# EAGLE schematic etherchess (EAGLE 7.3.0)
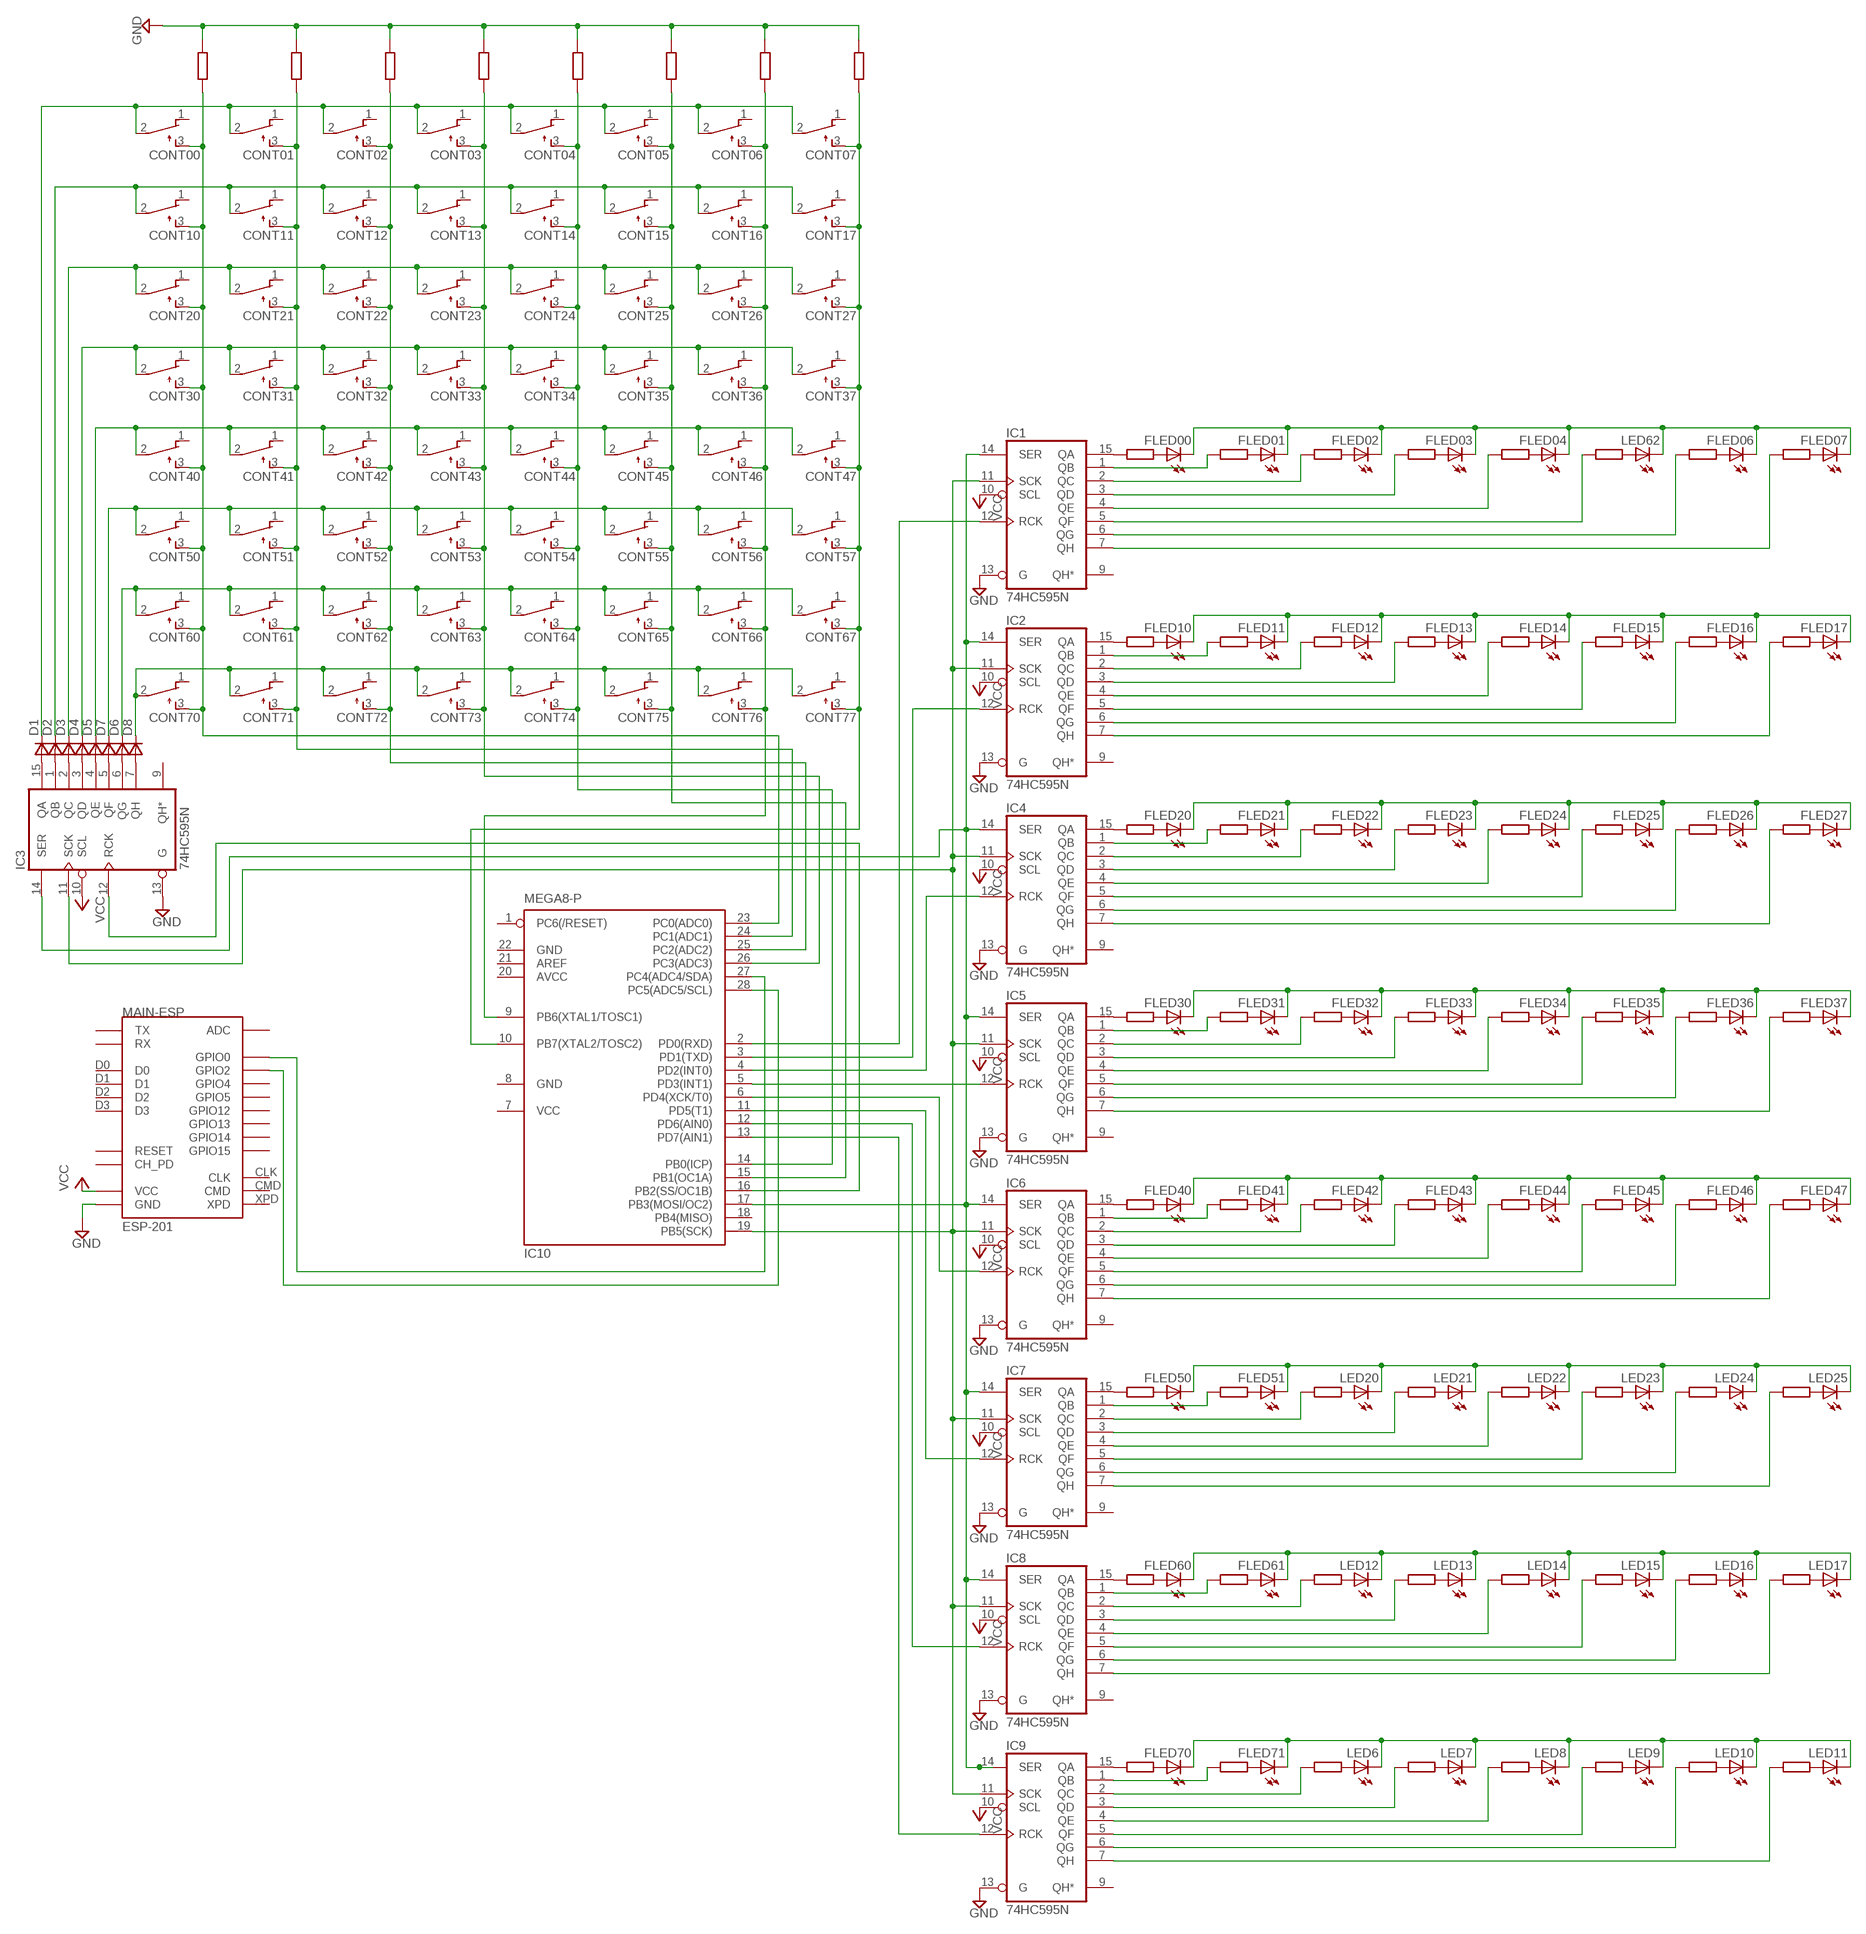
[diagram p0: schematic, sheet 1]

## Parts
CONT00  TL32PO  [TL3XPO]
CONT01  TL32PO  [TL3XPO]
CONT02  TL32PO  [TL3XPO]
CONT03  TL32PO  [TL3XPO]
CONT04  TL32PO  [TL3XPO]
CONT05  TL32PO  [TL3XPO]
CONT06  TL32PO  [TL3XPO]
CONT07  TL32PO  [TL3XPO]
CONT10  TL32PO  [TL3XPO]
CONT11  TL32PO  [TL3XPO]
CONT12  TL32PO  [TL3XPO]
CONT13  TL32PO  [TL3XPO]
CONT14  TL32PO  [TL3XPO]
CONT15  TL32PO  [TL3XPO]
CONT16  TL32PO  [TL3XPO]
CONT17  TL32PO  [TL3XPO]
CONT20  TL32PO  [TL3XPO]
CONT21  TL32PO  [TL3XPO]
CONT22  TL32PO  [TL3XPO]
CONT23  TL32PO  [TL3XPO]
CONT24  TL32PO  [TL3XPO]
CONT25  TL32PO  [TL3XPO]
CONT26  TL32PO  [TL3XPO]
CONT27  TL32PO  [TL3XPO]
CONT30  TL32PO  [TL3XPO]
CONT31  TL32PO  [TL3XPO]
CONT32  TL32PO  [TL3XPO]
CONT33  TL32PO  [TL3XPO]
CONT34  TL32PO  [TL3XPO]
CONT35  TL32PO  [TL3XPO]
CONT36  TL32PO  [TL3XPO]
CONT37  TL32PO  [TL3XPO]
CONT40  TL32PO  [TL3XPO]
CONT41  TL32PO  [TL3XPO]
CONT42  TL32PO  [TL3XPO]
CONT43  TL32PO  [TL3XPO]
CONT44  TL32PO  [TL3XPO]
CONT45  TL32PO  [TL3XPO]
CONT46  TL32PO  [TL3XPO]
CONT47  TL32PO  [TL3XPO]
CONT50  TL32PO  [TL3XPO]
CONT51  TL32PO  [TL3XPO]
CONT52  TL32PO  [TL3XPO]
CONT53  TL32PO  [TL3XPO]
CONT54  TL32PO  [TL3XPO]
CONT55  TL32PO  [TL3XPO]
CONT56  TL32PO  [TL3XPO]
CONT57  TL32PO  [TL3XPO]
CONT60  TL32PO  [TL3XPO]
CONT61  TL32PO  [TL3XPO]
CONT62  TL32PO  [TL3XPO]
CONT63  TL32PO  [TL3XPO]
CONT64  TL32PO  [TL3XPO]
CONT65  TL32PO  [TL3XPO]
CONT66  TL32PO  [TL3XPO]
CONT67  TL32PO  [TL3XPO]
CONT70  TL32PO  [TL3XPO]
CONT71  TL32PO  [TL3XPO]
CONT72  TL32PO  [TL3XPO]
CONT73  TL32PO  [TL3XPO]
CONT74  TL32PO  [TL3XPO]
CONT75  TL32PO  [TL3XPO]
CONT76  TL32PO  [TL3XPO]
CONT77  TL32PO  [TL3XPO]
D1  DSOD323  [SOD323]
D2  DSOD323  [SOD323]
D3  DSOD323  [SOD323]
D4  DSOD323  [SOD323]
D5  DSOD323  [SOD323]
D6  DSOD323  [SOD323]
D7  DSOD323  [SOD323]
D8  DSOD323  [SOD323]
FLED00  LED5MM  [LED5MM]
FLED01  LED5MM  [LED5MM]
FLED02  LED5MM  [LED5MM]
FLED03  LED5MM  [LED5MM]
FLED04  LED5MM  [LED5MM]
FLED06  LED5MM  [LED5MM]
FLED07  LED5MM  [LED5MM]
FLED10  LED5MM  [LED5MM]
FLED11  LED5MM  [LED5MM]
FLED12  LED5MM  [LED5MM]
FLED13  LED5MM  [LED5MM]
FLED14  LED5MM  [LED5MM]
FLED15  LED5MM  [LED5MM]
FLED16  LED5MM  [LED5MM]
FLED17  LED5MM  [LED5MM]
FLED20  LED5MM  [LED5MM]
FLED21  LED5MM  [LED5MM]
FLED22  LED5MM  [LED5MM]
FLED23  LED5MM  [LED5MM]
FLED24  LED5MM  [LED5MM]
FLED25  LED5MM  [LED5MM]
FLED26  LED5MM  [LED5MM]
FLED27  LED5MM  [LED5MM]
FLED30  LED5MM  [LED5MM]
FLED31  LED5MM  [LED5MM]
FLED32  LED5MM  [LED5MM]
FLED33  LED5MM  [LED5MM]
FLED34  LED5MM  [LED5MM]
FLED35  LED5MM  [LED5MM]
FLED36  LED5MM  [LED5MM]
FLED37  LED5MM  [LED5MM]
FLED40  LED5MM  [LED5MM]
FLED41  LED5MM  [LED5MM]
FLED42  LED5MM  [LED5MM]
FLED43  LED5MM  [LED5MM]
FLED44  LED5MM  [LED5MM]
FLED45  LED5MM  [LED5MM]
FLED46  LED5MM  [LED5MM]
FLED47  LED5MM  [LED5MM]
FLED50  LED5MM  [LED5MM]
FLED51  LED5MM  [LED5MM]
FLED60  LED5MM  [LED5MM]
FLED61  LED5MM  [LED5MM]
FLED70  LED5MM  [LED5MM]
FLED71  LED5MM  [LED5MM]
IC1  74HC595N  [DIL16]
IC2  74HC595N  [DIL16]
IC3  74HC595N  [DIL16]
IC4  74HC595N  [DIL16]
IC5  74HC595N  [DIL16]
IC6  74HC595N  [DIL16]
IC7  74HC595N  [DIL16]
IC8  74HC595N  [DIL16]
IC9  74HC595N  [DIL16]
IC10  MEGA8-P  [DIL28-3]
LED6  LED5MM  [LED5MM]
LED7  LED5MM  [LED5MM]
LED8  LED5MM  [LED5MM]
LED9  LED5MM  [LED5MM]
LED10  LED5MM  [LED5MM]
LED11  LED5MM  [LED5MM]
LED12  LED5MM  [LED5MM]
LED13  LED5MM  [LED5MM]
LED14  LED5MM  [LED5MM]
LED15  LED5MM  [LED5MM]
LED16  LED5MM  [LED5MM]
LED17  LED5MM  [LED5MM]
LED20  LED5MM  [LED5MM]
LED21  LED5MM  [LED5MM]
LED22  LED5MM  [LED5MM]
LED23  LED5MM  [LED5MM]
LED24  LED5MM  [LED5MM]
LED25  LED5MM  [LED5MM]
LED62  LED5MM  [LED5MM]
MAIN-ESP  ESP-201  [ESP-201]

## Nets
GND: IC1.13(G) IC2.13(G) IC3.13(G) IC4.13(G) IC5.13(G) IC6.13(G) IC7.13(G) IC8.13(G) IC9.13(G) MAIN-ESP.GND MAIN-ESP.GND_2(GND) MAIN-ESP.GND_3(GND)
N$1: IC2.1(QB)
N$2: IC2.2(QC)
N$3: IC2.3(QD)
N$4: IC2.4(QE)
N$5: IC2.5(QF)
N$6: IC2.6(QG)
N$7: IC2.7(QH)
N$8: IC4.1(QB)
N$9: IC4.2(QC)
N$10: IC4.3(QD)
N$11: IC4.4(QE)
N$12: IC4.5(QF)
N$13: IC4.6(QG)
N$14: IC4.7(QH)
N$15: IC5.1(QB)
N$16: IC5.2(QC)
N$17: IC1.1(QB)
N$18: CONT70.2(P) CONT71.2(P) CONT72.2(P) CONT73.2(P) CONT74.2(P) CONT75.2(P) CONT76.2(P) CONT77.2(P) D8.1(C)
N$19: CONT60.2(P) CONT61.2(P) CONT62.2(P) CONT63.2(P) CONT64.2(P) CONT65.2(P) CONT66.2(P) CONT67.2(P) D6.1(C)
N$20: CONT50.2(P) CONT51.2(P) CONT52.2(P) CONT53.2(P) CONT54.2(P) CONT55.2(P) CONT56.2(P) CONT57.2(P) D7.1(C)
N$21: CONT40.2(P) CONT41.2(P) CONT42.2(P) CONT43.2(P) CONT44.2(P) CONT45.2(P) CONT46.2(P) CONT47.2(P) D5.1(C)
N$22: CONT30.2(P) CONT31.2(P) CONT32.2(P) CONT33.2(P) CONT34.2(P) CONT35.2(P) CONT36.2(P) CONT37.2(P) D4.1(C)
N$23: CONT20.2(P) CONT21.2(P) CONT22.2(P) CONT23.2(P) CONT24.2(P) CONT25.2(P) CONT26.2(P) CONT27.2(P) D3.1(C)
N$24: CONT10.2(P) CONT11.2(P) CONT12.2(P) CONT13.2(P) CONT14.2(P) CONT15.2(P) CONT16.2(P) CONT17.2(P) D2.1(C)
N$25: CONT00.2(P) CONT01.2(P) CONT02.2(P) CONT03.2(P) CONT04.2(P) CONT05.2(P) CONT06.2(P) CONT07.2(P) D1.1(C)
N$26: CONT00.3(S) CONT10.3(S) CONT20.3(S) CONT30.3(S) CONT40.3(S) CONT50.3(S) CONT60.3(S) CONT70.3(S) IC10.23(PC0(ADC0))
N$27: CONT01.3(S) CONT11.3(S) CONT21.3(S) CONT31.3(S) CONT41.3(S) CONT51.3(S) CONT61.3(S) CONT71.3(S) IC10.24(PC1(ADC1))
N$28: CONT02.3(S) CONT12.3(S) CONT22.3(S) CONT32.3(S) CONT42.3(S) CONT52.3(S) CONT62.3(S) CONT72.3(S) IC10.25(PC2(ADC2))
N$29: CONT03.3(S) CONT13.3(S) CONT23.3(S) CONT33.3(S) CONT43.3(S) CONT53.3(S) CONT63.3(S) CONT73.3(S) IC10.26(PC3(ADC3))
N$30: CONT04.3(S) CONT14.3(S) CONT24.3(S) CONT34.3(S) CONT44.3(S) CONT54.3(S) CONT64.3(S) CONT74.3(S) IC10.14(PB0(ICP))
N$31: CONT05.3(S) CONT15.3(S) CONT25.3(S) CONT35.3(S) CONT45.3(S) CONT55.3(S) CONT65.3(S) CONT75.3(S) IC10.15(PB1(OC1A))
N$32: CONT06.3(S) CONT16.3(S) CONT26.3(S) CONT36.3(S) CONT46.3(S) CONT56.3(S) CONT66.3(S) CONT76.3(S) IC10.9(PB6(XTAL1/TOSC1))
N$33: CONT07.3(S) CONT17.3(S) CONT27.3(S) CONT37.3(S) CONT47.3(S) CONT57.3(S) CONT67.3(S) CONT77.3(S) IC10.10(PB7(XTAL2/TOSC2))
N$34: IC1.2(QC)
N$35: IC1.14(SER) IC2.14(SER) IC3.14(SER) IC4.14(SER) IC5.14(SER) IC6.14(SER) IC7.14(SER) IC8.14(SER) IC9.14(SER) IC10.17(PB3(MOSI/OC2))
N$36: IC1.3(QD)
N$37: IC1.4(QE)
N$38: IC1.5(QF)
N$39: IC1.6(QG)
N$40: IC1.7(QH)
N$41: IC5.3(QD)
N$42: IC5.4(QE)
N$43: IC5.5(QF)
N$44: IC5.6(QG)
N$45: IC5.7(QH)
N$46: IC6.1(QB)
N$47: IC6.2(QC)
N$48: IC6.3(QD)
N$49: IC6.4(QE)
N$50: IC6.5(QF)
N$51: IC6.6(QG)
N$52: IC6.7(QH)
N$53: IC7.1(QB)
N$54: IC7.2(QC)
N$55: IC7.3(QD)
N$56: IC7.4(QE)
N$57: IC7.5(QF)
N$58: IC7.6(QG)
N$59: IC7.7(QH)
N$60: IC8.1(QB)
N$61: IC8.2(QC)
N$62: IC8.3(QD)
N$63: IC8.4(QE)
N$64: IC8.5(QF)
N$65: IC8.6(QG)
N$66: IC8.7(QH)
N$67: IC9.1(QB)
N$68: IC9.2(QC)
N$69: IC9.3(QD)
N$70: IC9.4(QE)
N$71: IC9.5(QF)
N$72: IC9.6(QG)
N$73: IC9.7(QH)
N$74: IC3.12(RCK) IC10.16(PB2(SS/OC1B))
N$75: IC1.11(SCK) IC2.11(SCK) IC3.11(SCK) IC4.11(SCK) IC5.11(SCK) IC6.11(SCK) IC7.11(SCK) IC8.11(SCK) IC9.11(SCK) IC10.19(PB5(SCK))
N$76: IC6.12(RCK) IC10.6(PD4(XCK/T0))
N$77: IC5.12(RCK) IC10.5(PD3(INT1))
N$78: IC4.12(RCK) IC10.4(PD2(INT0))
N$79: IC2.12(RCK) IC10.3(PD1(TXD))
N$80: IC1.12(RCK) IC10.2(PD0(RXD))
N$81: IC7.12(RCK) IC10.11(PD5(T1))
N$82: IC8.12(RCK) IC10.12(PD6(AIN0))
N$83: IC9.12(RCK) IC10.13(PD7(AIN1))
N$84: D1.2(A) IC3.15(QA)
N$85: D2.2(A) IC3.1(QB)
N$86: D3.2(A) IC3.2(QC)
N$87: D4.2(A) IC3.3(QD)
N$88: D5.2(A) IC3.4(QE)
N$89: D6.2(A) IC3.6(QG)
N$90: D7.2(A) IC3.5(QF)
N$91: D8.2(A) IC3.7(QH)
N$92: FLED00.K(C) FLED01.K(C) FLED02.K(C) FLED03.K(C) FLED04.K(C) FLED06.K(C) FLED07.K(C) LED62.K(C)
N$93: FLED10.K(C) FLED11.K(C) FLED12.K(C) FLED13.K(C) FLED14.K(C) FLED15.K(C) FLED16.K(C) FLED17.K(C)
N$94: FLED20.K(C) FLED21.K(C) FLED22.K(C) FLED23.K(C) FLED24.K(C) FLED25.K(C) FLED26.K(C) FLED27.K(C)
N$95: FLED30.K(C) FLED31.K(C) FLED32.K(C) FLED33.K(C) FLED34.K(C) FLED35.K(C) FLED36.K(C) FLED37.K(C)
N$96: FLED40.K(C) FLED41.K(C) FLED42.K(C) FLED43.K(C) FLED44.K(C) FLED45.K(C) FLED46.K(C) FLED47.K(C)
N$97: FLED50.K(C) FLED51.K(C) LED20.K(C) LED21.K(C) LED22.K(C) LED23.K(C) LED24.K(C) LED25.K(C)
N$98: FLED60.K(C) FLED61.K(C) LED12.K(C) LED13.K(C) LED14.K(C) LED15.K(C) LED16.K(C) LED17.K(C)
N$99: FLED70.K(C) FLED71.K(C) LED6.K(C) LED7.K(C) LED8.K(C) LED9.K(C) LED10.K(C) LED11.K(C)
N$100: IC10.27(PC4(ADC4/SDA)) MAIN-ESP.GPIO0
N$101: IC10.28(PC5(ADC5/SCL)) MAIN-ESP.GPIO2
VCC: IC1.10(SCL) IC2.10(SCL) IC3.10(SCL) IC4.10(SCL) IC5.10(SCL) IC6.10(SCL) IC7.10(SCL) IC8.10(SCL) IC9.10(SCL) MAIN-ESP.3V3(VCC) MAIN-ESP.3V3_2(VCC) MAIN-ESP.3V3_3(VCC)
Unconnected: CONT00.1(O) CONT01.1(O) CONT02.1(O) CONT03.1(O) CONT04.1(O) CONT05.1(O) CONT06.1(O) CONT07.1(O) CONT10.1(O) CONT11.1(O) CONT12.1(O) CONT13.1(O) CONT14.1(O) CONT15.1(O) CONT16.1(O) CONT17.1(O) CONT20.1(O) CONT21.1(O) CONT22.1(O) CONT23.1(O) CONT24.1(O) CONT25.1(O) CONT26.1(O) CONT27.1(O) CONT30.1(O) CONT31.1(O) CONT32.1(O) CONT33.1(O) CONT34.1(O) CONT35.1(O) CONT36.1(O) CONT37.1(O) CONT40.1(O) CONT41.1(O) CONT42.1(O) CONT43.1(O) CONT44.1(O) CONT45.1(O) CONT46.1(O) CONT47.1(O) CONT50.1(O) CONT51.1(O) CONT52.1(O) CONT53.1(O) CONT54.1(O) CONT55.1(O) CONT56.1(O) CONT57.1(O) CONT60.1(O) CONT61.1(O) CONT62.1(O) CONT63.1(O) CONT64.1(O) CONT65.1(O) CONT66.1(O) CONT67.1(O) CONT70.1(O) CONT71.1(O) CONT72.1(O) CONT73.1(O) CONT74.1(O) CONT75.1(O) CONT76.1(O) CONT77.1(O) FLED00.A FLED01.A FLED02.A FLED03.A FLED04.A FLED06.A FLED07.A FLED10.A FLED11.A FLED12.A FLED13.A FLED14.A FLED15.A FLED16.A FLED17.A FLED20.A FLED21.A FLED22.A FLED23.A FLED24.A FLED25.A FLED26.A FLED27.A FLED30.A FLED31.A FLED32.A FLED33.A FLED34.A FLED35.A FLED36.A FLED37.A FLED40.A FLED41.A FLED42.A FLED43.A FLED44.A FLED45.A FLED46.A FLED47.A FLED50.A FLED51.A FLED60.A FLED61.A FLED70.A FLED71.A IC1.9(QH*) IC1.15(QA) IC2.9(QH*) IC2.15(QA) IC3.9(QH*) IC4.9(QH*) IC4.15(QA) IC5.9(QH*) IC5.15(QA) IC6.9(QH*) IC6.15(QA) IC7.9(QH*) IC7.15(QA) IC8.9(QH*) IC8.15(QA) IC9.9(QH*) IC9.15(QA) IC10.1(PC6(/RESET)) IC10.18(PB4(MISO)) IC10.21(AREF) LED6.A LED7.A LED8.A LED9.A LED10.A LED11.A LED12.A LED13.A LED14.A LED15.A LED16.A LED17.A LED20.A LED21.A LED22.A LED23.A LED24.A LED25.A LED62.A MAIN-ESP.ADC MAIN-ESP.CH_PD MAIN-ESP.CLK MAIN-ESP.CMD MAIN-ESP.D0 MAIN-ESP.D1 MAIN-ESP.D2 MAIN-ESP.D3 MAIN-ESP.GPIO4 MAIN-ESP.GPIO5 MAIN-ESP.GPIO12 MAIN-ESP.GPIO13 MAIN-ESP.GPIO14 MAIN-ESP.GPIO15 MAIN-ESP.RST(RESET) MAIN-ESP.RX MAIN-ESP.TX MAIN-ESP.XPD

## Power pins joined to a net without a drawn wire
AVCC: IC10.20(AVCC)
GND: IC1.8(GND) IC2.8(GND) IC3.8(GND) IC4.8(GND) IC5.8(GND) IC6.8(GND) IC7.8(GND) IC8.8(GND) IC9.8(GND) IC10.8(GND) IC10.22(GND)
VCC: IC1.16(VCC) IC2.16(VCC) IC3.16(VCC) IC4.16(VCC) IC5.16(VCC) IC6.16(VCC) IC7.16(VCC) IC8.16(VCC) IC9.16(VCC) IC10.7(VCC)

## Library data of the parts
CONT00 CONT01-CONT07 CONT10-CONT17 CONT20-CONT27 CONT30-CONT37 CONT40-CONT47 CONT50-CONT57 CONT60-CONT67 CONT70-CONT77 = switch:TL32PO: TINY SWITCH ON - MOM Source: http://www2.produktinfo.conrad.com/datenblaetter/700000-724999/705152-da-01-de-Subminiaturschalter_TL_36YO.pdf
D1-D8 = zetex:D: DIODE; MPN: CDSOD323-T05C; OC_FARNELL: 1824860; OC_NEWARK: 79R6078
FLED00 FLED01-FLED04 FLED06 FLED07 FLED10-FLED17 FLED20-FLED27 FLED30-FLED37 FLED40-FLED47 FLED50 FLED51 FLED60 FLED61 FLED70 FLED71 LED6-LED17 LED20-LED25 LED62 = led:LED: LED OSRAM: - CHIPLED LG R971, LG N971, LY N971, LG Q971, LY Q971, LO R971, LY R971 LH N974, LH R974 LS Q976, LO Q976, LY Q976 LO Q996 - Hyper CHIPLED LW Q18S LB Q993, LB Q99A, LB R99A - SideLED LS A670, LO A670, LY A670, LG A670, LP A670 LB A673, LV A673, LT A673, LW A673 LH A674 LY A675 LS A676, LA A676, LO A676, LY A676, LW A676 LS A679, LY A679, LG A679 - Hyper Micro SIDELED® LS Y876, LA Y876, LO Y876, LY Y876 LT Y87S - SmartLED LW L88C, LW L88S LB L89C, LB L89S, LG L890 LS L89K, LO L89K, LY L89K LS L896, LA L896, LO L896, LY L896 - TOPLED LS T670, LO T670, LY T670, LG T670, LP T670 LSG T670, LSP T670, LSY T670, LOP T670, LYG T670 LG T671, LOG T671, LSG T671 LB T673, LV T673, LT T673, LW T673 LH T674 LS T676, LA T676, LO T676, LY T676, LB T676, LH T676, LSB T676, LW T676 LB T67C, LV T67C, LT T67C, LS T67K, LO T67K, LY T67K, LW E67C LS E67B, LA E67B, LO E67B, LY E67B, LB E67C, LV E67C, LT E67C LW T67C LS T679, LY T679, LG T679 LS T770, LO T770, LY T770, LG T770, LP T770 LB T773, LV T773, LT T773, LW T773 LH T774 LS E675, LA E675, LY E675, LS T675 LS T776, LA T776, LO T776, LY T776, LB T776 LHGB T686 LT T68C, LB T68C - Hyper Mini TOPLED® LB M676 - Mini TOPLED Santana® LG M470 LS M47K, LO M47K, LY M47K Source: http://www.osram.convergy.de LUXEON: - LUMILED® LXK2-PW12-R00, LXK2-PW12-S00, LXK2-PW14-U00, LXK2-PW14-V00 LXK2-PM12-R00, LXK2-PM12-S00, LXK2-PM14-U00 LXK2-PE12-Q00, LXK2-PE12-R00, LXK2-PE12-S00, LXK2-PE14-T00, LXK2-PE14-U00 LXK2-PB12-K00, LXK2-PB12-L00, LXK2-PB12-M00, LXK2-PB14-N00, LXK2-PB14-P00, LXK2-PB14-Q00 LXK2-PR12-L00, LXK2-PR12-M00, LXK2-PR14-Q00, LXK2-PR14-R00 LXK2-PD12-Q00, LXK2-PD12-R00, LXK2-PD12-S00 LXK2-PH12-R00, LXK2-PH12-S00 LXK2-PL12-P00, LXK2-PL12-Q00, LXK2-PL12-R00 Source: www.luxeon.com KINGBRIGHT: KA-3528ASYC Source: www.kingbright.com
IC1-IC9 = 74xx-eu:74*595: 8-bit SHIFT REGISTER, output latch
IC10 = atmel:MEGA8-P: MICROCONTROLLER 8 Kbytes FLASH, 1 kbytes SRAM, 512 bytes EEPROM, USART, 4-channel 10 bit ADC, 2-channel 8 bit ADC Pin compatible with Atmega48, ATMega88, ATMega168 Source: avr.lbr; OC_FARNELL: unknown; OC_NEWARK: unknown
MAIN-ESP = esp8266modules:ESP-201: ESP8266 Wifi Module ESP-201; DIMENSIONS: 25 x 35 mm; PINS: 26; PITCH: 0.1" / 2.54 mm